# EAGLE schematic lirc (EAGLE 6.2)
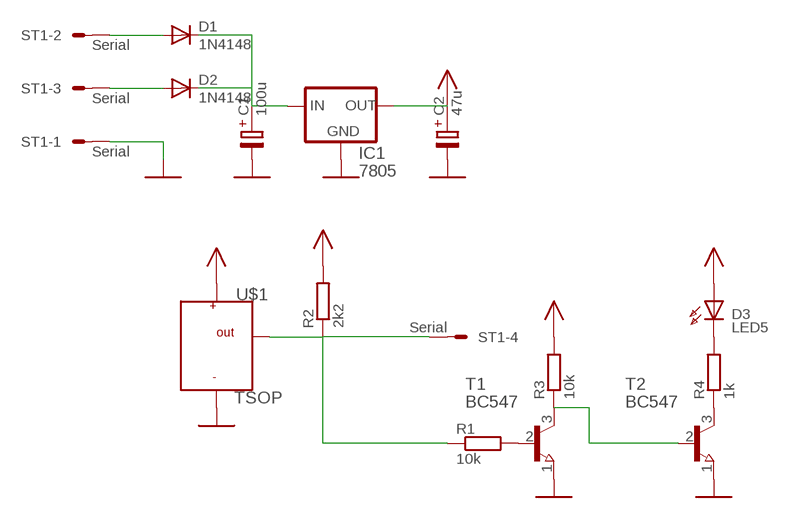
[diagram p0: schematic, sheet 1]

## Parts
C1  100u  E30-10  [E30-10]
C2  47u  E25-10  [E25-10]
D1  1N4148  [DO35-10]
D2  1N4148  [DO35-10]
D3  LED5  [LED5]
IC1  7805  78XXS  [78XXS]
R1  10k  0207/10  [0207/10]
R2  2k2  0207/10  [0207/10]
R3  10k  0207/10  [0207/10]
R4  1k  0207/10  [0207/10]
ST1  Serial  MSF4  [MSF4]
T1  BC547  [TO92]
T2  BC547  [TO92]
U$1  TSOP  [TSOP]

## Nets
GND: C1.- C2.- IC1.GND ST1.1 T1.1(E) T2.1(E) U$1.-
N$1: C1.+ D1.K D2.K IC1.IN
N$2: R4.1 T2.3(C)
N$3: R3.1 T1.3(C) T2.2(B)
N$4: R1.2 T1.2(B)
N$5: D3.K R4.2
N$6: D1.A ST1.2
N$7: D2.A ST1.3
N$8: R1.1 R2.1 ST1.4 U$1.OUT
VCC: C2.+ D3.A IC1.OUT R2.2 R3.2 U$1.+

## Library data of the parts
C1 = polcap:E30-10
C2 = polcap:E25-10
D1 D2 = diode:1N4148
D3 = led:LED5
IC1 = v-reg:78XXS
R1-R4 = r:0207/10
ST1 = con-msf:MSF4
T1 T2 = npn:BC547
U$1 = titi:TSOP